# EAGLE schematic Lab_5_4 (EAGLE 9.2.2)
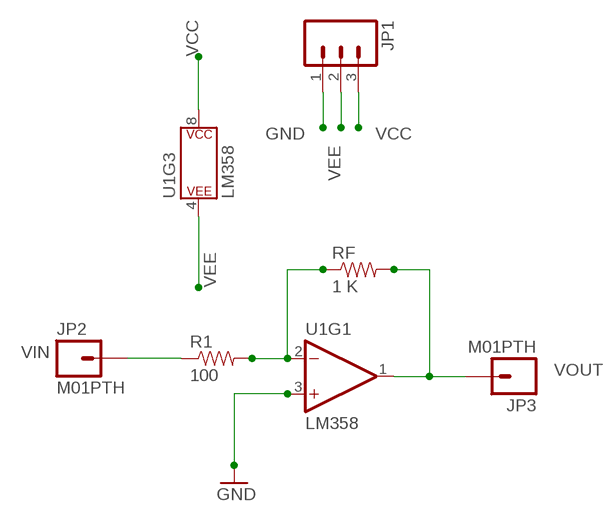
[diagram p0: schematic, sheet 1]

## Parts
JP1  M03LOCK  [1X03_LOCK]
JP2  M01PTH  [1X01]
JP3  M01PTH  [1X01]
R1  100  RESISTOR1206  [1206]
RF  1 K  RESISTOR1206  [1206]
U1  LM358  LM358KIT  [DIP08-KIT]

## Nets
FDBCK: R1.2 RF.1 U1.2(-IN)
GND: JP1.1 U1.3(+IN)
VCC: JP1.3 U1.8(P$V+)
VEE: JP1.2 U1.4(P$V-)
VIN: JP2.1 R1.1
VOUT: JP3.1 RF.2 U1.1(OUT)
Unconnected: U1.5(+IN) U1.6(-IN) U1.7(OUT)

## Library data of the parts
JP1 = SparkFun:M03: Header 3 Standard 3-pin 0.1" header. Use with straight break away headers (SKU : PRT-00116), right angle break away headers (PRT-00553), swiss pins (PRT-00743), machine pins (PRT-00117), and female headers (PRT-00115). Molex polarized connector foot print use with SKU : PRT-08232 with associated crimp pins and housings.
JP2 JP3 = SparkFun:M01: Header 1 Standard 1-pin 0.1" header. Use with straight break away headers (SKU : PRT-00116), right angle break away headers (PRT-00553), swiss pins (PRT-00743), machine pins (PRT-00117), and female headers (PRT-00115).
R1 RF = SparkFun:RESISTOR: Resistor Basic schematic elements and footprints for 0603, 1206, and PTH 1/10th watt (small) resistors.
U1 = SparkFun-IC-Amplifiers:LM358: LM358 Jellybean op-amp Datasheet <http://www.sparkfun.com/datasheets/Components/General/LM358.pdf> SparkFun Products Op-Amp (Thru-Hole) - LM358 <https://www.sparkfun.com/products/9456> (COM-09456); PROD_ID: IC-09172